# Altium project project.PrjPCB
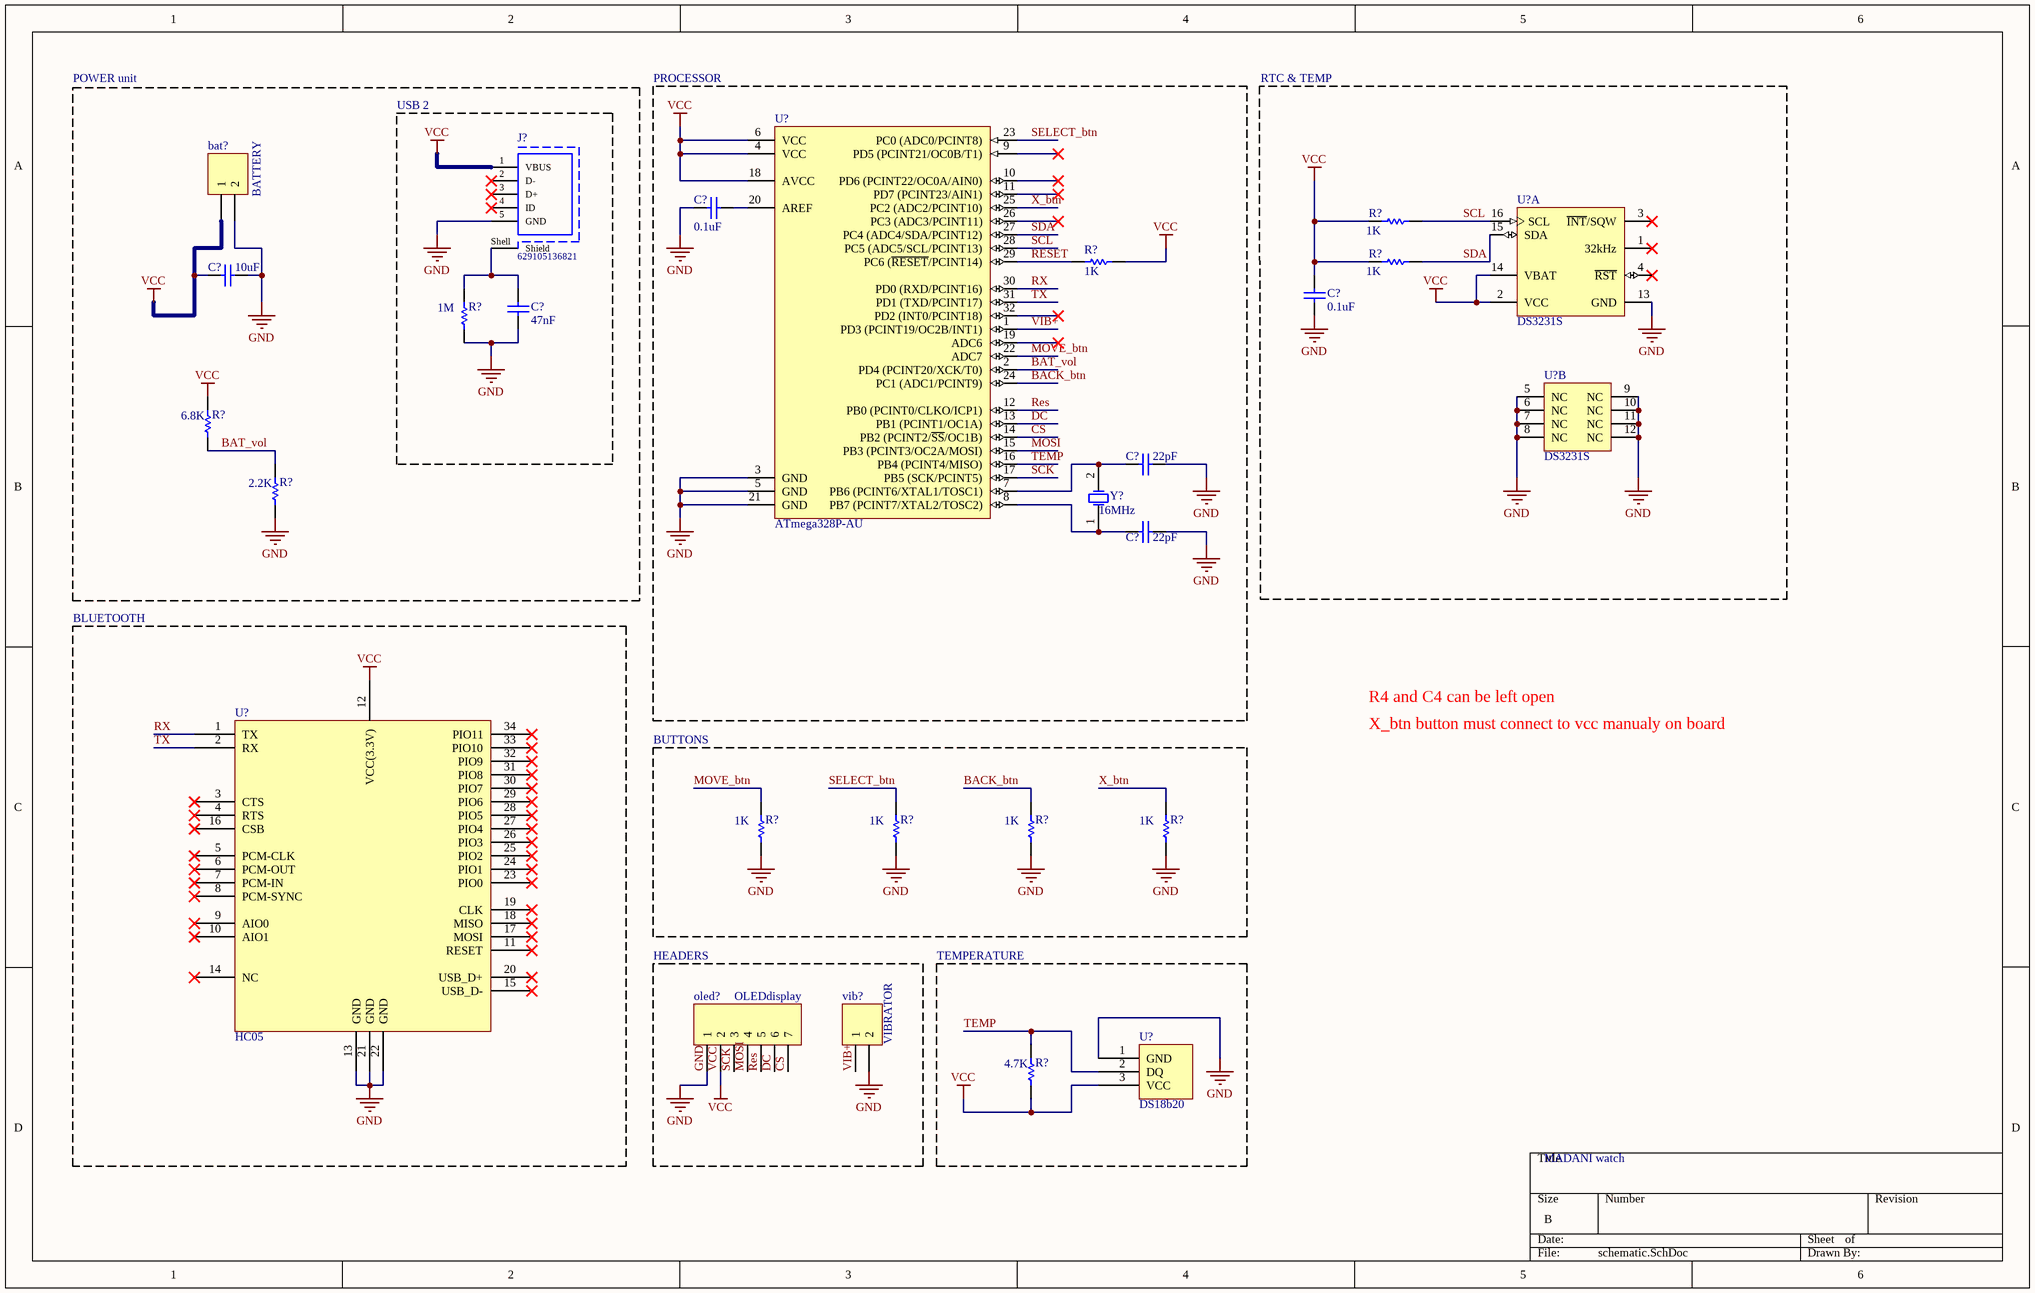
[diagram p0: schematic.SchDoc]
1 sheet, 27 parts. Net scope: global (net labels, ports and power ports of the same name join across sheets).

## Sheet schematic.SchDoc
size B

### Parts
(Parts that share a designator on the sheet are numbered #1, #2 ... from top to bottom, then left to right.)
bat?  BATTERY  [HDR1X2]
C?#1  value 0.1uF  [0603]  (hidden comment: Cap)
C?#2  value 10uF  [0805]  (hidden comment: Cap)
C?#3  value 0.1uF  [0603]  (hidden comment: Cap)
C?#4  value 47nF  [0603]  (hidden comment: Cap)
C?#5  value 22pF  [0603]  (hidden comment: Cap)
C?#6  value 22pF  [0603]  (hidden comment: Cap)
J?  629105136821  [629105136821]
oled?  OLEDdisplay  [HDR1X7]
R?#1  value 1K  [0603]  (hidden comment: Res1)
R?#2  value 1K  [0603]  (hidden comment: Res1)
R?#3  value 1K  [0603]  (hidden comment: Res1)
R?#4  value 1M  [0603]  (hidden comment: Res1)
R?#5  value 6.8K  [0603]  (hidden comment: Res1)
R?#6  value 2.2K  [0603]  (hidden comment: Res1)
R?#7  value 1K  [0603]  (hidden comment: Res1)
R?#8  value 1K  [0603]  (hidden comment: Res1)
R?#9  value 1K  [0603]  (hidden comment: Res1)
R?#10  value 1K  [0603]  (hidden comment: Res1)
R?#11  value 4.7K  [0603]  (hidden comment: Res1)
U?#1  ATmega328P-AU  [TQFP32]
U?#2  DS3231S  [W16-H2_N]  (part A of 2)
U?#3  DS3231S  [W16-H2_N]  (part B of 2)
U?#4  HC05  [HC-05]
U?#5  DS18b20  [TO92]
vib?  VIBRATOR  [HDR1X2]
Y?  16MHz  [HC_49S_SMD]

### Blocks framed on the sheet
POWER unit: bat? C?#2 R?#5 R?#6
USB 2: C?#4 J? R?#4
PROCESSOR: C?#1 C?#5 C?#6 R?#2 U?#1 Y?
RTC & TEMP: C?#3 R?#1 R?#3 U?#2 U?#3
BLUETOOTH: U?#4
BUTTONS: R?#7-R?#10
HEADERS: oled? vib?
TEMPERATURE: R?#11 U?#5

### Nets
GND: bat?.2 C?#1.1 C?#2.2 C?#3.2 C?#4.1 C?#5.2 C?#6.2 J?.5(GND) oled?.1 R?#4.1 R?#6.1 R?#7.1 R?#8.1 R?#9.1 R?#10.1 U?#1.3(GND) U?#1.5(GND) U?#1.21(GND) U?#2.13(GND) U?#3.5(NC) U?#3.6(NC) U?#3.7(NC) U?#3.8(NC) U?#3.9(NC) U?#3.10(NC) U?#3.11(NC) U?#3.12(NC) U?#4.13(GND) U?#4.21(GND) U?#4.22(GND) U?#5.1(GND) vib?.2
VCC: bat?.1 C?#2.1 C?#3.1 J?.1(VBUS) oled?.2 R?#1.2 R?#2.1 R?#3.2 R?#5.2 R?#11.1 U?#1.4(VCC) U?#1.6(VCC) U?#1.18(AVCC) U?#2.2(VCC) U?#2.14(VBAT) U?#4.12(VCC(3.3V)) U?#5.3(VCC)
BACK_btn: R?#9.2 U?#1.24(PC1_(ADC1/PCINT9))
BAT_vol: R?#5.1 R?#6.2 U?#1.2(PD4_(PCINT20/XCK/T0))
CS: oled?.7 U?#1.14(PB2_(PCINT2/~{SS}/OC1B))
DC: oled?.6 U?#1.13(PB1_(PCINT1/OC1A))
MOSI: oled?.4 U?#1.15(PB3_(PCINT3/OC2A/MOSI))
MOVE_btn: R?#7.2 U?#1.22(ADC7)
Res: oled?.5 U?#1.12(PB0_(PCINT0/CLKO/ICP1))
RESET: R?#2.2 U?#1.29(PC6_(~{RESET}/PCINT14))
RX: U?#1.30(PD0_(RXD/PCINT16)) U?#4.1(TX)
SCK: oled?.3 U?#1.17(PB5_(SCK/PCINT5))
SCL: R?#1.1 U?#1.28(PC5_(ADC5/SCL/PCINT13)) U?#2.16(SCL)
SDA: R?#3.1 U?#1.27(PC4_(ADC4/SDA/PCINT12)) U?#2.15(SDA)
SELECT_btn: R?#8.2 U?#1.23(PC0_(ADC0/PCINT8))
TEMP: R?#11.2 U?#1.16(PB4_(PCINT4/MISO)) U?#5.2(DQ)
TX: U?#1.31(PD1_(TXD/PCINT17)) U?#4.2(RX)
VIB+: U?#1.1(PD3_(PCINT19/OC2B/INT1)) vib?.1
X_btn: R?#10.2 U?#1.25(PC2_(ADC2/PCINT10))
NetC?#1_2: C?#1.2 U?#1.20(AREF)
NetC?#4_2: C?#4.2 J?.Shell(Shield) R?#4.2
NetC?#5_1: C?#5.1 U?#1.7(PB6_(PCINT6/XTAL1/TOSC1)) Y?.2(OSC2)
NetC?#6_1: C?#6.1 U?#1.8(PB7_(PCINT7/XTAL2/TOSC2)) Y?.1(OSC1)

Not connected (* = marked no-connect by the designer): J? 2(D-)* 3(D+)* 4(ID)*; U?#1 9(PD5_(PCINT21/OC0B/T1))* 10(PD6_(PCINT22/OC0A/AIN0))* 11(PD7_(PCINT23/AIN1))* 19(ADC6)* 26(PC3_(ADC3/PCINT11))* 32(PD2_(INT0/PCINT18))*; U?#2 1(32kHz)* 3(~{INT}/SQW)* 4(~{RST})*; U?#4 3(CTS)* 4(RTS)* 5(PCM-CLK)* 6(PCM-OUT)* 7(PCM-IN)* 8(PCM-SYNC)* 9(AIO0)* 10(AIO1)* 11(RESET)* 14(NC)* 15(USB_D-)* 16(CSB)* 17(MOSI)* 18(MISO)* 19(CLK)* 20(USB_D+)* 23(PIO0)* 24(PIO1)* 25(PIO2)* 26(PIO3)* 27(PIO4)* 28(PIO5)* 29(PIO6)* 30(PIO7)* 31(PIO8)* 32(PIO9)* 33(PIO10)* 34(PIO11)*

### Notes on the sheet
- R4 and C4 can be left open
- X_btn button must connect to vcc manualy on board
- MADANI watch

### Library data of the parts
bat? vib? = Header 2: Header, 2-Pin; LatestRevisionDate: 17-Jul-2002; LatestRevisionNote: Re-released for DXP Platform.; Publisher: Altium Limited
C?#1-C?#6 = Cap: Capacitor; Published: 8-Jun-2000; LatestRevisionDate: 17-Jul-2002; LatestRevisionNote: Re-released for DXP Platform.; PackageReference: RAD-0.3; Publisher: Altium Limited; PackageDescription: Radial Cap, Thru-Hole; 2 Leads; 0.3 in Pin Spacing
J? = 629105136821: Micro USB 2.0 Type B Receptacle WR-COM, Horizontal, SMT, with Pads and Pegs; Rated Current: 1 A; Contact Resistance: 30 mOhm; Working Voltage: 30 VAC; ComponentLink1Description: Manufacturer; ComponentLink1URL: http://www.we-online.de; ComponentLink2Description: Datasheet; ComponentLink2URL: https://katalog.we-online.de/em/datasheet/629105136821.pdf; Part Number: 629105136821; Published Date: September 2018; Publisher: Wurth Elektronik; Orientation: Horizontal; Connector Type: Micro USB 2.0 Type B; Operating Temperature: -40 to 105 degC; Mounting Technology: SMT; Gender: Receptacle; Packaging: Tape and Reel
oled? = Header 7: Header, 7-Pin; LatestRevisionDate: 17-Jul-2002; LatestRevisionNote: Re-released for DXP Platform.; Publisher: Altium Limited
R?#1-R?#11 = Res1: Resistor; Published: 8-Jun-2000; LatestRevisionDate: 17-Jul-2002; LatestRevisionNote: Re-released for DXP Platform.; PackageReference: AXIAL-0.3; Publisher: Altium Limited; PackageDescription: Axial Device, Thru-Hole; 2 Leads; 0.3 in Pin Spacing
U?#1 = ATmega328P-AU: 8-bit AVR Microcontroller, 32KB Flash, 1KB EEPROM, 2KB SRAM, 32-pin TQFP, Industrial Grade (-40°C to 85°C); Published: 1-Apr-2010; DatasheetVersion: revA, Jan-2010; PackageVersion: revB, Oct-2001; PackageReference: 32A; Publisher: Altium Limited; PackageDescription: 32-Lead, 7x7x1.0 mm Body, 0.8mm Lead Pitch, Thin Profile Plastic Quad Flat Package (TQFP); Supplier 1: Digi-Key; Supplier Part Number 1: ATMEGA328P-AU-ND; Supplier 2: Farnell; Supplier Part Number 2: 1715486; Supplier 3: Mouser; Supplier Part Number 3: 556-ATMEGA328P-AU; Code_JEDEC: MS-026-ABA; ComponentLink1Description: Manufacturer Link; ComponentLink1URL: http://www.atmel.com/products/avr/default.asp?; ComponentLink2Description: ATmega48A/48PA/88A/88PA/168A/168PA/328/328P Datasheet; ComponentLink2URL: http://www.atmel.com/dyn/resources/prod_documents/8271.pdf; ComponentLink3Description: ATmega48A/48PA/88A/88PA/168A/168PA/328/328P Summary; ComponentLink3URL: http://www.atmel.com/dyn/resources/prod_documents/8271S.pdf; ComponentLink4Description: Atmel.com Home; ComponentLink4URL: http://www.atmel.com
U?#2 U?#3 = DS3231S: Extremely Accurate I2C-Integrated Real-Time Clock/TCXO/Crystal, 16-Pin SO, 0 to 70 degC; DatasheetVersion: Rev 8, Jul-2010; PackageVersion: revD, 2010; PackageReference: W16-H2; PackageDescription: 16-Pin Small-Outline IC, Wide (0.3in), 1.27 mm Pitch, SOIC (W); Code_JEDEC: MS-013-AA; Code_IPC: SOIC127P1030-16; ComponentLink1Description: Manufacturer URL; ComponentLink1URL: http://www.maxim-ic.com; ComponentLink2Description: Datasheet; ComponentLink2URL: http://datasheets.maxim-ic.com/en/ds/DS3231.pdf; ComponentLink3Description: Package Specification; ComponentLink3URL: http://pdfserv.maxim-ic.com/package_dwgs/21-0042.PDF
U?#4 = HC05: Bluetooth module
U?#5 = Component_1
Y? = XTAL: Crystal Oscillator; Published: 8-Jun-2000; LatestRevisionDate: 17-Jul-2002; LatestRevisionNote: Re-released for DXP Platform.; PackageReference: R38; Publisher: Altium Limited; PackageDescription: Crystal, Thru-Hole; 2 Leads; Body 3.1 x 8.2 mm (Dia.xH)